# EasyEDA Pro project AD637峰值_运放峰值_AGC_AD8367_万能运放.eprj, board PCB1
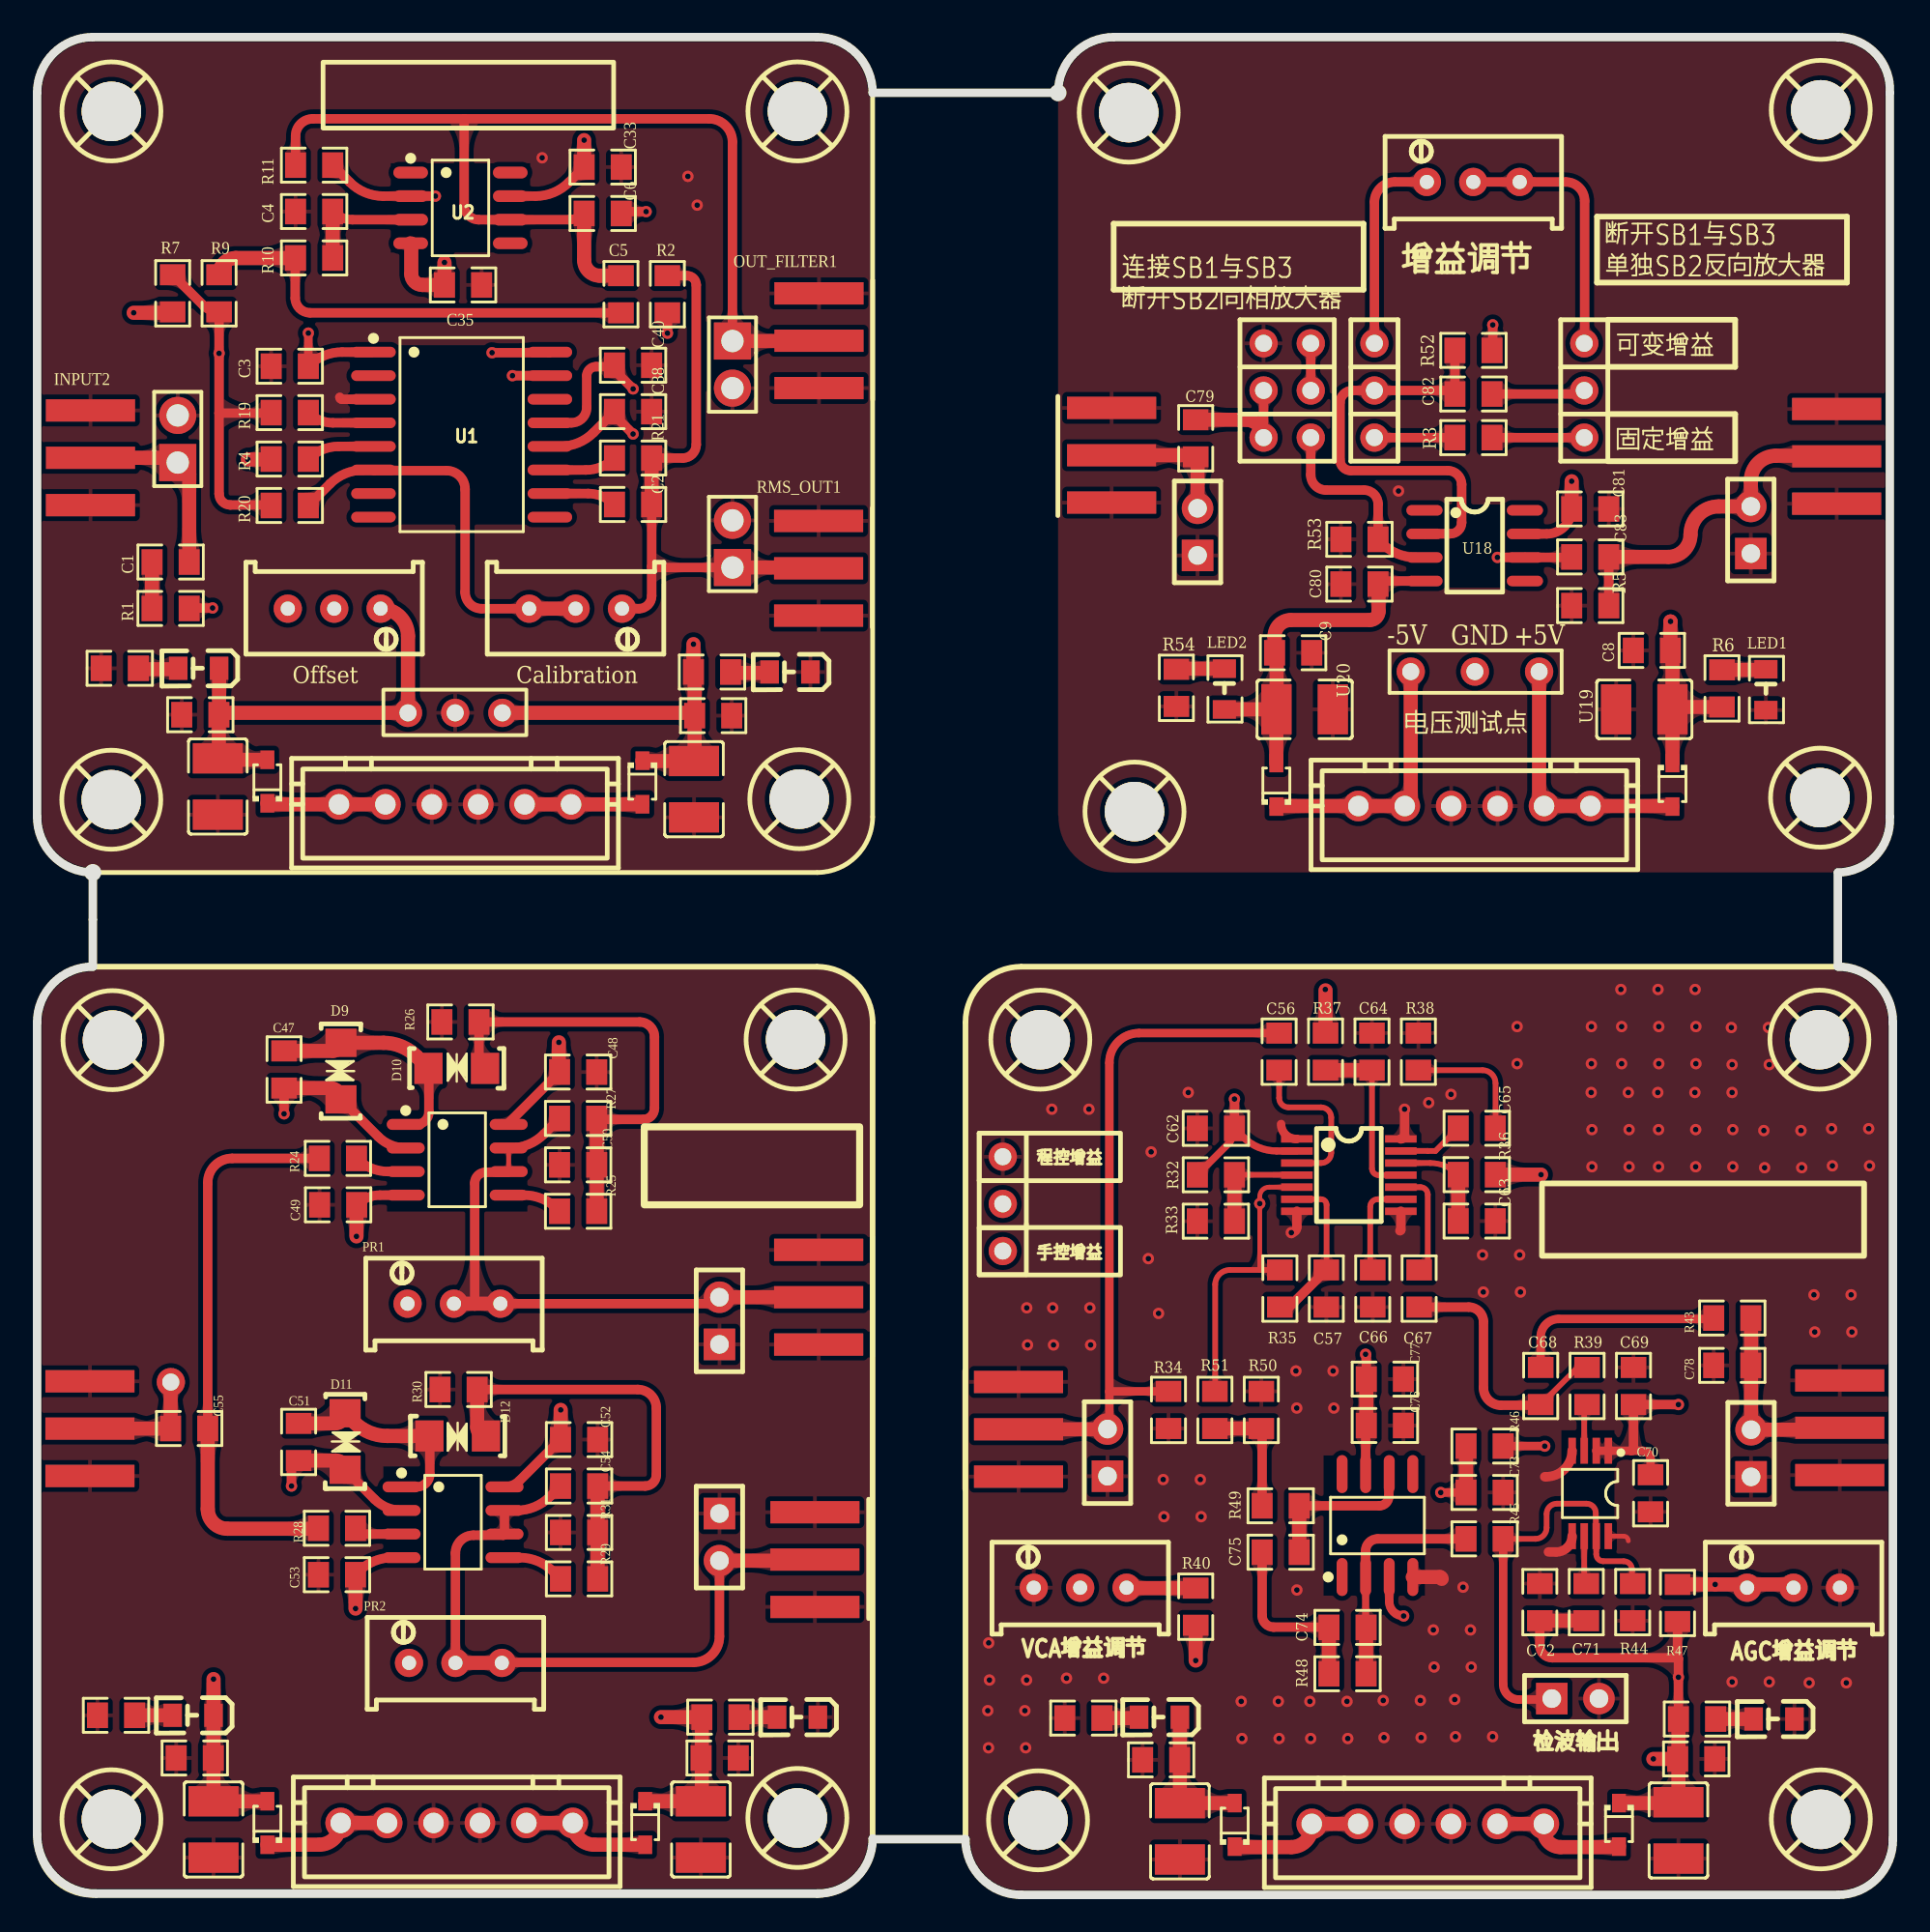
[diagram p3: board, top side]
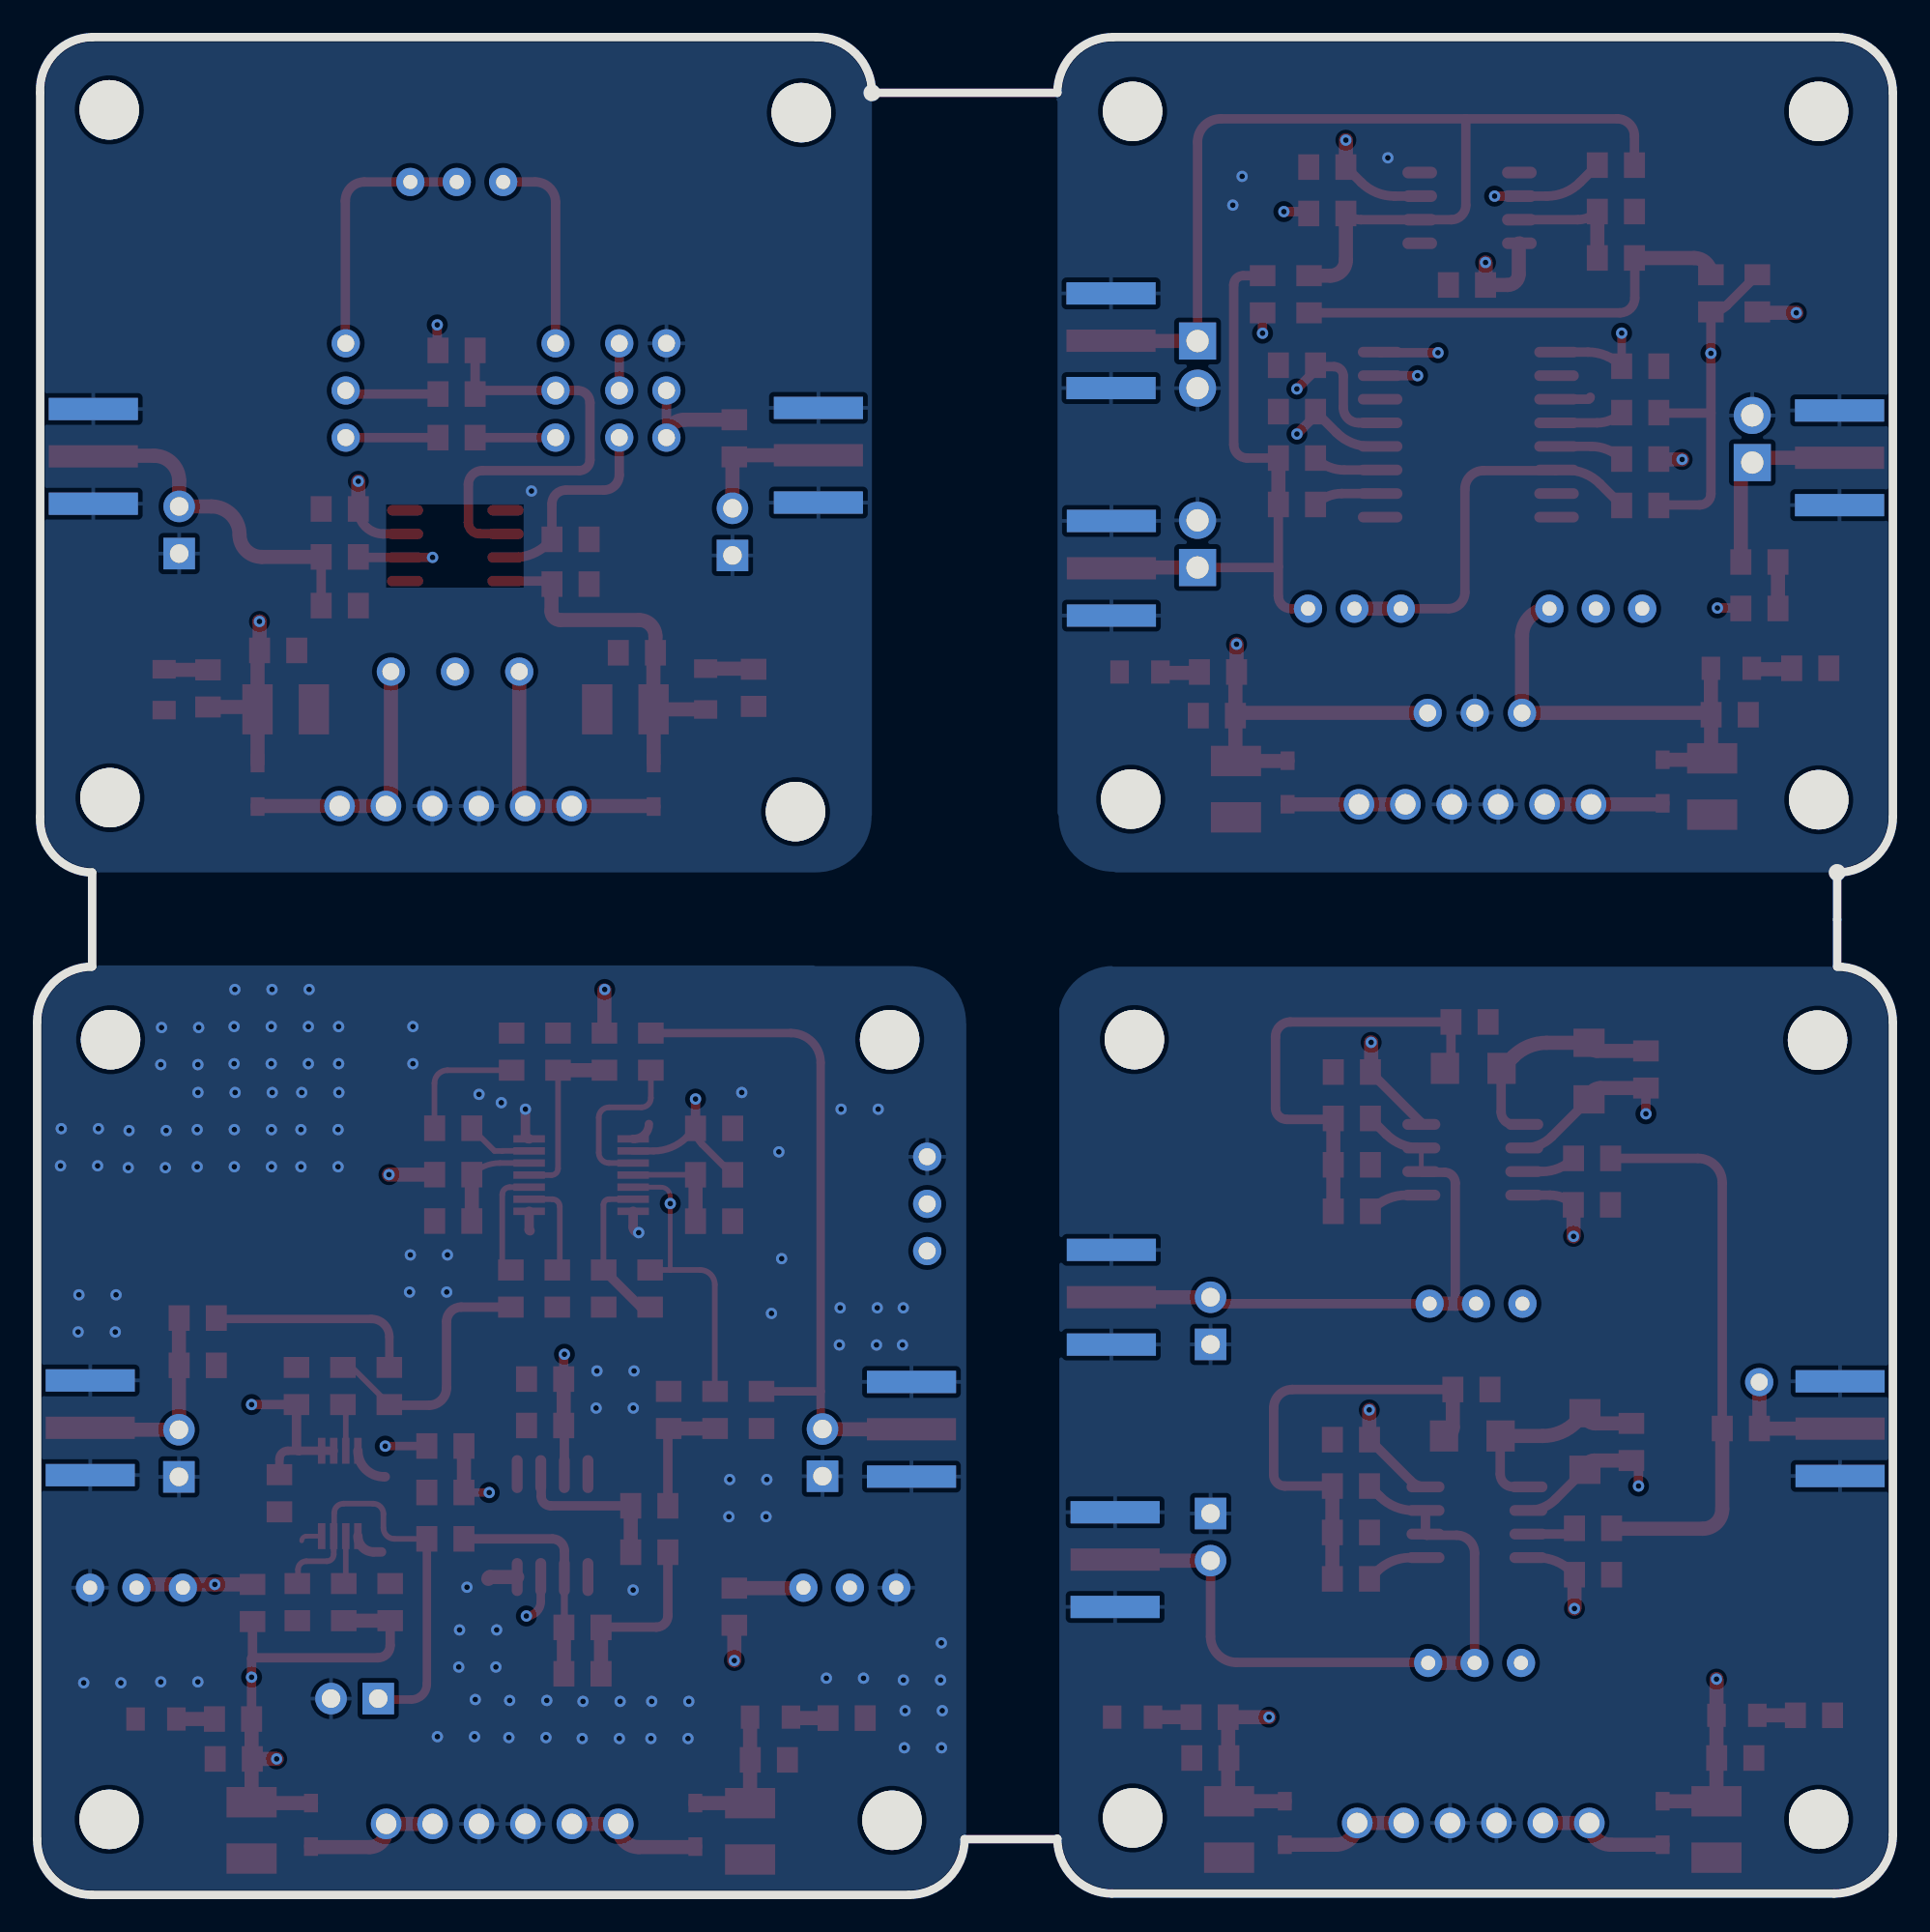
[diagram p4: board, bottom side, seen from below]

Outline 99.95 x 100.07 mm; copper layers: Top Layer, Inner1, Inner2, Bottom Layer. Coordinates in mm from the lower left corner of the outline.
Outline path: 0,97.07 arc(0.88,99.19) 3,100.07 42,100.07 arc(44.12,99.19) 45,97.07 54.99,97.07 arc(55.87,99.19) 57.99,100.07 96.99,100.07 arc(99.03,99.17) 99.79,97.07 99.79,58.07 arc(99.03,55.97) 96.99,55.07 96.99,50.01 arc(96.99,50) 97,50 arc(99.1,49.12) 99.95,47 99.95,3 arc(99.1,0.88) 97,0 53,0 arc(50.88,0.88) 50,3 45.02,3 arc(45.01,3.01) 45,3.02 arc(44.14,0.94) 42.05,0.07 3.17,0.07 arc(0.93,1) 0,3.24 0,47 arc(0.88,49.12) 3,50 3,55.07 arc(0.88,55.95) 0,58.07 0,97.07
Stack: Top Layer 0.035mm 外层铜厚1oz / Dielectric1 0.2104mm 7628 RC49% 8.6mil / Inner1 0.0152mm 内层铜厚 / Dielectric2 1.065mm 1.1mm H/HOZ Copper / Inner2 0.0152mm 内层铜厚 / Dielectric3 0.2104mm 7628 RC49% 8.6mil / Bottom Layer 0.035mm 外层铜厚1oz

## Design rules (mm)
template: JLCPCB Capability(Two Layers Board)
spacing copperThickness1oz (default): track to track 0.102, other pairs 0.152 to 0.3
spacing copperThickness2oz: track to track 0.203, other pairs 0.152 to 0.3
track width copperThickness1oz (default): min 0.127, default 0.254, max 2.54
track width copperThickness2oz: min 0.203, default 0.254, max 2.54
differential pair differentialPair (default): width min 0.127, default 0.254, max 2.54; gap min 0.152, default 0.152
via viaSize (default): diameter min 0.5, default 0.61, max 10; hole min 0.3, default 0.305, max 6.3

## Placement (name value [footprint] x y rotation side)
C1  10uF  [R0805#2]  7.3 71.8 0 top
C2  1uF  [R0805#2]  32.21 74.9 0 top
C3  10uF  [R0805#2]  13.5 82.34 180 top
C4  1uF  [R0805#2]  14.81 90.68 180 top
C5  1uF  [R0805#2]  31.44 86.33 90 top
C6  100nF  [R0805#2]  30.35 90.57 180 top
C8  0.1uF  [R0805#2]  87.08 67.04 0 top
C9  0.1uF  [R0805#2]  67.76 66.91 0 top
C25  100nF  [R0805#2]  8.9 63.57 0 top
C26  100nF  [R0805#2]  36.3 63.52 180 top
C33  100nF  [R0805#2]  30.35 93.07 180 top
C35  100nF  [R0805#2]  23.05 86.72 0 top
C38  100nF  [R0805#2]  32.21 79.9 0 top
C40  100nF  [R0805#2]  31.99 82.4 180 top
C41  22uF  [C1210]  35.38 59.56 90 top
C42  22uF  [C1210]  9.73 59.71 90 top
C43  100nF  [R0805#2]  8.6 7.37 0 top
C44  100nF  [R0805#2]  36.65 7.37 180 top
C45  22uF  [C1210]  35.75 3.52 90 top
C46  22uF  [C1210]  9.5 3.52 90 top
C47  100nF  [R0805#2]  13.3 44.57 90 top
C48  100nF  [R0805#2]  29.25 44.32 0 top
C49  100nF  [R0805#2]  16.1 37.17 180 top
C50  100nF  [R0805#2]  29.25 39.32 0 top
C51  100nF  [R0805#2]  14.08 24.51 90 top
C52  100nF  [R0805#2]  29.3 24.52 0 top
C53  100nF  [R0805#2]  16.04 17.25 180 top
C54  100nF  [R0805#2]  29.3 19.52 0 top
C55  100nF  [R0805#2]  8.3 25.12 0 top
C56  10nF  [R0805#2]  66.89 45.31 270 top
C57  100nF  [R0805#2]  69.44 32.77 90 top
C58  100nF  [R0805#2]  60.65 7.27 0 top
C59  100nF  [R0805#2]  89.25 7.32 180 top
C60  22uF  [C1210]  88.4 3.47 90 top
C61  22uF  [C1210]  61.55 3.42 90 top
C62  1uF  [R0805#2]  63.6 41.29 0 top
C63  100nF  [R0805#2]  77.43 36.3 180 top
C64  100nF  [R0805#2]  71.89 45.53 90 top
C65  10uF  [R0805#2]  77.65 41.3 0 top
C66  10uF  [R0805#2]  71.94 32.55 270 top
C67  10nF  [R0805#2]  74.44 32.55 270 top
C68  10nF  [R0805#2]  80.98 27.52 90 top
C69  100nF  [R0805#2]  85.98 27.52 90 top
C70  10nF  [R0805#2]  86.9 21.52 270 top
C71  270nF  [R0805#2]  83.44 15.66 270 top
C72  10nF  [R0805#2]  80.94 15.88 90 top
C73  100nF  [R0805#2]  77.85 21.68 180 top
C74  20pF  [R0805#2]  70.47 14.41 180 top
C75  3.3nF  [R0805#2]  66.87 18.46 180 top
C76  100nF  [R0805#2]  72.7 25.28 0 top
C77  10nF  [R0805#2]  72.7 27.78 0 top
C78  nc  [R0805#2]  91.19 28.52 180 top
C79  100pF  [R0805#2]  62.4 78.57 90 top
C80  104  [R0805#2]  71.33 70.61 0 top
C81  104  [R0805#2]  83.54 74.66 180 top
C82  33pF  [R0805#2]  77.47 80.85 0 top
C83  100pF  [R0805#2]  83.76 72.07 0 top
Calibration  10kΩ  [RES-ADJ-TH_3P-L10.0-W10.0-P2.50-L]  29 69.28 180 top
CN23  XH2.54*6P_直插  [CONN-TH_XH2.54-6P]  22.51 58.74 0 top
CN24  XH2.54*6P_直插  [CONN-TH_XH2.54-6P]  22.6 3.87 0 top
CN25  XH2.54*6P_直插  [CONN-TH_XH2.54-6P]  74.9 3.82 0 top
CN26  XH2.54*6P_直插  [CONN-TH_XH2.54-6P]  77.41 58.65 0 top
D1  SD103AWS  [SOD-323_L1.8-W1.3-LS2.5-RD]  32.6 59.92 270 top
D2  SD103AWS  [SOD-323_L1.8-W1.3-LS2.5-RD]  12.4 59.97 90 top
D3  led0805  [LED0805-RD]  40.55 65.87 180 top
D4  led0805  [LED0805-RD]  8.7 66.07 180 top
D5  led0805  [LED0805-RD]  40.95 9.57 180 top
D6  led0805  [LED0805-RD]  8.4 9.67 180 top
D7  SD103AWS  [SOD-323_L1.8-W1.3-LS2.5-RD]  32.75 3.87 270 top
D8  SD103AWS  [SOD-323_L1.8-W1.3-LS2.5-RD]  12.4 3.87 90 top
D9  IN60  [LL-34_L3.5-W1.5-BI]  16.36 44.38 90 top
D10  IN60  [LL-34_L3.5-W1.5-BI]  22.6 44.52 0 top
D11  IN60  [LL-34_L3.5-W1.5-BI]  16.59 24.42 270 top
D12  IN60  [LL-34_L3.5-W1.5-BI]  22.65 24.72 180 top
D13  led0805  [LED0805-RD]  93.55 9.47 180 top
D14  led0805  [LED0805-RD]  60.45 9.57 180 top
D15  SD103AWS  [SOD-323_L1.8-W1.3-LS2.5-RD]  85.2 3.77 270 top
D16  SD103AWS  [SOD-323_L1.8-W1.3-LS2.5-RD]  64.5 3.77 90 top
D17  SD103AWS  [SOD-323_L1.8-W1.3-LS2.5-RD]  88.08 59.8 270 top
D18  SD103AWS  [SOD-323_L1.8-W1.3-LS2.5-RD]  66.74 59.8 90 top
H1  -  [HDR-TH_2P-P2.54-V-F]  36.75 30.92 90 top
H2  -  [HDR-TH_2P-P2.54-V-F]  36.75 19.27 270 top
H3  -  [HDR-TH_2P-P2.54-V-F]  82.85 10.57 0 top
H5  -  [HDR-TH_2P-P2.54-V-F]  57.65 23.82 90 top
H6  -  [HDR-TH_2P-P2.54-V-F]  92.31 23.79 90 top
H7  -  [HDR-TH_2P-P2.54-V-F]  62.5 73.42 90 top
H8  -  [HDR-TH_2P-P2.54-V-F]  92.3 73.52 90 top
INPUT2  PZ254V-11-02P  [HDR-TH_2P-P2.54-V-M]  7.57 78.42 90 top
LED1  -  [LED_0805]  93.12 64.97 90 top
LED2  -  [LED_0805]  63.95 65 90 top
NOREF  -  [Pad_e860]  73.98 65.89 0 top
NOREF#2  -  [Pad_e74]  19.98 63.67 0 top
NOREF#3  -  [Pad_e75]  22.52 63.67 0 top
NOREF#4  -  [Pad_e78]  25.06 63.67 0 top
NOREF#5  -  [Pad_e110]  7.2 27.62 0 top
NOREF#6  -  [Pad_e861]  77.44 65.89 0 top
NOREF#7  -  [Pad_e862]  80.9 65.89 0 top
Offset  100kΩ  [RES-ADJ-TH_3P-L10.0-W10.0-P2.50-L]  16 69.28 180 top
OUT_FILTER1  PZ254V-11-02P  [HDR-TH_2P-P2.54-V-M]  37.45 82.43 270 top
PR1  10kΩ  [R_3296]  22.45 31.97 0 top
PR2  10kΩ  [R_3296]  22.53 12.62 0 top
PR3  10kΩ  [R_3296]  56.18 16.67 0 top
PR4  10kΩ  [R_3296]  94.6 16.67 0 top
PR5  10kΩ  [R_3296]  77.35 92.4 0 top
R1  100  [R0805]  7.19 69.3 180 top
R2  500k  [R0805]  33.94 86.22 90 top
R3  511Ω  [R0805]  77.36 78.5 0 top
R4  4.7KΩ  [R0805]  13.61 77.34 0 top
R5  51Ω  [R0805]  83.65 69.45 180 top
R6  1K  [R0805]  90.75 64.99 270 top
R7  1MΩ  [R0805]  7.3 86.27 90 top
R9  1M  [R0805]  9.8 86.27 90 top
R10  1M  [R0805]  14.92 88.18 0 top
R11  2.2M  [R0805]  14.92 93.18 180 top
R17  10K  [R0805]  4.45 66.07 0 top
R18  10K  [R0805]  36.35 65.87 0 top
R19  0  [R0805]  13.61 79.84 0 top
R20  0  [R0805]  13.61 74.84 0 top
R21  0  [R0805]  32.1 77.4 0 top
R22  10K  [R0805]  4.25 9.67 0 top
R23  10K  [R0805]  36.8 9.57 0 top
R24  10K  [R0805]  16.2 39.67 0 top
R25  10K  [R0805]  29.14 36.82 180 top
R26  10K  [R0805]  22.8 47.02 0 top
R27  10K  [R0805]  29.14 41.82 180 top
R28  10K  [R0805]  16.15 19.75 0 top
R29  10K  [R0805]  29.19 17.02 180 top
R30  10K  [R0805]  22.7 27.22 0 top
R31  10K  [R0805]  29.19 22.02 180 top
R32  10K  [R0805]  63.49 38.79 0 top
R33  10K  [R0805]  63.49 36.29 0 top
R34  57.6  [R0805]  60.93 26.12 90 top
R35  10K  [R0805]  66.94 32.66 270 top
R36  2.2  [R0805]  77.54 38.8 0 top
R37  2.2  [R0805]  69.39 45.42 90 top
R38  100  [R0805]  74.39 45.42 270 top
R39  100  [R0805]  83.48 27.41 270 top
R40  10K  [R0805]  62.4 15.52 270 top
R41  10K  [R0805]  56.35 9.52 0 top
R42  10K  [R0805]  89.4 9.47 0 top
R43  50  [R0805]  91.3 31.07 0 top
R44  12K  [R0805]  85.94 15.77 90 top
R45  150  [R0805]  77.96 19.18 0 top
R46  50  [R0805]  77.96 24.18 0 top
R47  1K  [R0805]  88.35 15.72 270 top
R48  82K  [R0805]  70.58 11.91 180 top
R49  33k  [R0805]  66.98 20.96 180 top
R50  10K  [R0805]  65.93 26.12 90 top
R51  10K  [R0805]  63.43 26.12 270 top
R52  51Ω  [R0805]  77.36 83.2 180 top
R53  51Ω  [R0805]  71.22 73.02 0 top
R54  1K  [R0805]  61.36 65.02 90 top
RMS_OUT1  PZ254V-11-02P  [HDR-TH_2P-P2.54-V-M]  37.45 72.77 90 top
SCREW1  -  [M3螺丝]  4 96.07 0 top
SCREW2  -  [M3螺丝]  40.95 96.07 0 top
SCREW3  -  [M3螺丝]  3.99 58.99 0 top
SCREW4  -  [M3螺丝]  41.05 59.02 0 top
SCREW5  -  [M3螺丝]  58.79 96.01 0 top
SCREW6  -  [M3螺丝]  59.1 58.36 0 top
SCREW7  -  [M3螺丝]  96.07 96.16 0 top
SCREW8  -  [M3螺丝]  96.03 59.11 0 top
SCREW9  -  [M3螺丝]  53.91 4.02 0 top
SCREW10  -  [M3螺丝]  96.07 4.07 0 top
SCREW11  -  [M3螺丝]  54.03 46.07 0 top
SCREW12  -  [M3螺丝]  95.99 46.07 0 top
SCREW13  -  [M3螺丝]  4 4.07 0 top
SCREW14  -  [M3螺丝]  40.95 4.14 0 top
SCREW15  -  [M3螺丝]  4.06 46.04 0 top
SCREW16  -  [M3螺丝]  40.85 46.07 0 top
U1  AD637ARZ  [SOIC-16_L10.3-W7.5-P1.27-LS10.3-BL]  22.87 78.66 270 top
U2  OP07  [SOP-8_L4.9-W3.9-P1.27-LS6.0-BL]  22.8 90.87 270 top
U3  -  [SMA]  45.92 89.58 180 top
U4  -  [SMA]  -0.94 71.55 0 top
U5  -  [SMA]  45.9 77.32 180 top
U6  NE5532DR  [SOIC-8_L4.9-W3.9-P1.27-LS6.0-BL]  22.62 39.6 270 top
U7  NE5532DR  [SOIC-8_L4.9-W3.9-P1.27-LS6.0-BL]  22.4 20.07 270 top
U8  -  [SMA]  -0.97 19.25 0 top
U9  -  [SMA]  45.9 38.06 180 top
U10  -  [SMA]  45.7 23.92 180 top
U11  AD8367ARUZ-RL7  [TSSOP-14_L5.0-W4.4-P0.65-LS6.4-BL]  70.65 38.77 270 top
U12  AD820ARZ  [SOIC-8_L4.9-W3.9-P1.27-LS6.0-BL]  72.19 19.89 0 top
U13  AD8361ARMZ  [MSOP-8_L3.0-W3.0-P0.65-LS4.9-BL]  83.65 21.62 180 top
U14  -  [1*3跳线]  52.01 39.76 180 top
U15  -  [SMA]  49.05 19.22 0 top
U16  -  [SMA]  100.9 31.02 180 top
U17  -  [3*3连跳线帽]  71.14 88.66 0 top
U18  -  [THS4001CD]  77.53 72.07 0 top
U19  100uF  [C1210]  86.56 63.86 0 top
U20  100uF  [C1210]  68.27 63.86 0 top
U21  -  [1*3选择跳线帽]  72.03 78.5 270 top
U22  -  [1*3选择跳线帽]  83.33 83.58 90 top
U23  -  [SMA]  54.06 71.69 0 top
U24  -  [SMA]  100.73 83.35 180 top

## Footprints (pads in the part's own frame, mm; a bottom-side part is the same pattern mirrored in y, then rotated)
1*3跳线
  round 1.524 hole 0.914: 1(0,5.08) 2(0,2.54) 3(0,0)
1*3选择跳线帽
  round 1.524 hole 0.914: 1(-5.08,0) 2(-2.54,0) 3(0,0)
3*3连跳线帽
  round 1.524 hole 0.914: 1(-5.08,-5.08) 2(-5.08,-7.62) 3(-5.08,-10.16) 4(-2.54,-5.08) 5(-2.54,-7.62) 6(-2.54,-10.16)
C1210
  rect 1.635x2.7 smd: 1(-1.518,0) 2(1.518,0)
CONN-TH_XH2.54-6P
  round 1.65 hole 1.1: 1(-6.25,0) 2(-3.75,0) 3(-1.25,0) 4(1.25,0) 5(3.75,0) 6(6.25,0)
HDR-TH_2P-P2.54-V-F
  rect 1.7x1.7 hole 1: 1(-1.27,0)
  round 1.7 hole 1: 2(1.27,0)
HDR-TH_2P-P2.54-V-M
  rect 2x2 hole 1.2: 1(-1.27,0)
  round 2 hole 1.2: 2(1.27,0)
LED0805-RD
  rect 1x1.25 smd: 1(-1.1,0) 2(1.1,0)
LED_0805
  rect 1x1.25 smd: 1(-1.15,0.005) 2(1.05,0.005)
LL-34_L3.5-W1.5-BI
  rect 1.524x1.677 smd: 1(-1.524,0) 2(1.524,0)
M3螺丝
  round 3.2 hole 3.2: 1(0,0)
MSOP-8_L3.0-W3.0-P0.65-LS4.9-BL
  rect 0.406x1.397 smd: 1(-0.975,-2.3) 2(-0.325,-2.3) 3(0.325,-2.3) 4(0.975,-2.3) 5(0.975,2.3) 6(0.325,2.3) 7(-0.325,2.3) 8(-0.975,2.3)
Pad_e74
  round 1.524 hole 0.914: 1(0,0)
Pad_e75
  round 1.524 hole 0.914: 2(0,0)
Pad_e78
  round 1.524 hole 0.914: 3(0,0)
Pad_e110
  round 1.524 hole 0.914: 1(0,0)
Pad_e860
  round 1.524 hole 0.914: 1(0,0)
Pad_e861
  round 1.524 hole 0.914: 2(0,0)
Pad_e862
  round 1.524 hole 0.914: 3(0,0)
R0805
  rect 1.133x1.377 smd: 1(-1,0) 2(1,0)
R0805#2
  rect 1.133x1.377 smd: 1(-1.111,0) 2(0.889,0)
R_3296
  round 1.524 hole 0.762: 1(-2.499,-0.127) 2(0,-0.127) 3(2.499,-0.127)
RES-ADJ-TH_3P-L10.0-W10.0-P2.50-L
  round 1.524 hole 0.762: 1(-2.5,0) 2(0,0) 3(2.5,0)
SMA
  rect 4.8x1.2 smd: 1(3.81,8.412) 2(3.81,3.312) 5(3.81,5.862)
  rect 4.8x1.2 smd far side: 3(3.81,3.312) 4(3.81,8.412)
SOD-323_L1.8-W1.3-LS2.5-RD
  rect 1x0.75 smd: 1(-1.173,0) 2(1.173,0)
SOIC-8_L4.9-W3.9-P1.27-LS6.0-BL
  oval 0.588x2.045 smd: 1(-1.905,-2.772) 2(-0.635,-2.772) 3(0.635,-2.772) 4(1.905,-2.772) 5(1.905,2.772) 6(0.635,2.772) 7(-0.635,2.772) 8(-1.905,2.772)
SOIC-16_L10.3-W7.5-P1.27-LS10.3-BL
  oval 0.574x2.401 smd: 1(-4.445,-4.75) 2(-3.175,-4.75) 3(-1.905,-4.75) 4(-0.635,-4.75) 5(0.635,-4.75) 6(1.905,-4.75) 7(3.175,-4.75) 8(4.445,-4.75) 9(4.445,4.75) 10(3.175,4.75) 11(1.905,4.75) 12(0.635,4.75) 13(-0.635,4.75) 14(-1.905,4.75) 15(-3.175,4.75) 16(-4.445,4.75)
SOP-8_L4.9-W3.9-P1.27-LS6.0-BL
  oval 0.63x1.865 smd: 1(-1.905,-2.683) 2(-0.635,-2.683) 3(0.635,-2.683) 4(1.905,-2.683) 5(1.905,2.683) 6(0.635,2.683) 7(-0.635,2.683) 8(-1.905,2.683)
THS4001CD
  oval 1.95x0.569 smd: 1(-2.804,2.51) 2(-2.804,1.24) 3(-2.804,-0.029) 4(-2.804,-1.3) 5(2.606,-1.3) 6(2.606,-0.029) 7(2.606,1.24) 8(2.606,2.51)
TSSOP-14_L5.0-W4.4-P0.65-LS6.4-BL
  rect 0.4x1.7 smd: 1(-1.95,-2.8) 2(-1.3,-2.8) 3(-0.65,-2.8) 4(0,-2.8) 5(0.65,-2.8) 6(1.3,-2.8) 7(1.95,-2.8) 8(1.95,2.8) 9(1.3,2.8) 10(0.65,2.8) 11(0,2.8) 12(-0.65,2.8) 13(-1.3,2.8) 14(-1.95,2.8)

## Nets
As in the schematic, except:
+5V: C26.2 C33.2 C40.2 C41.2 C44.2 C45.2 C48.1 C52.1 C59.2 C60.2 C62.2 C69.1 C70.1 C71.2 C72.1 C76.1 C77.1 D1.1 D7.1 D15.1 NOREF#4.3 Offset.3 R4.1 R18.1 R23.1 R32.1 R36.2 R37.2 R40.2 R42.1 R47.2 U1.13 U2.7 U6.8 U7.8 U11.2 U12.7 U13.1 U13.2
-5V: C9.1 C25.2 C35.1 C38.1 C42.2 C43.2 C46.2 C49.1 C53.1 C58.2 C61.2 C80.2 D2.2 D4.1 D6.1 D8.2 D14.1 D16.2 D18.2 LED2.1 NOREF#2.1 Offset.1 U1.12 U2.4 U6.4 U7.4 U18.4 U20.1
GND: C3.2 C4.2 C8.1 C9.2 C25.1 C26.1 C33.1 C35.2 C38.2 C40.1 C41.1 C42.1 C43.1 C44.1 C45.1 C46.1 C48.2 C49.2 C50.1 C52.2 C53.2 C54.1 C57.1 C58.1 C59.1 C60.1 C61.1 C62.1 C63.1 C64.2 C66.2 C69.2 C70.2 C72.2 C73.1 C76.2 C77.2 C78.2 C80.1 C81.1 CN23.3 CN23.4 CN24.3 CN24.4 CN25.3 CN25.4 CN26.3 CN26.4 D3.1 D5.1 D13.1 H1.1 H2.1 H3.2 H5.1 H6.1 H7.1 H8.1 INPUT2.2 LED1.1 NOREF#3.2 OUT_FILTER1.2 PR3.1 PR4.3 R5.2 R17.1 R22.1 R26.1 R30.1 R33.1 R34.1 R38.1 R41.1 R44.1 R50.2 R53.1 R54.1 RMS_OUT1.2 U1.3 U3.1 U3.2 U3.3 U3.4 U4.1 U4.2 U4.3 U4.4 U5.1 U5.2 U5.3 U5.4 U8.1 U8.2 U8.3 U8.4 U9.1 U9.2 U9.3 U9.4 U10.1 U10.2 U10.3 U10.4 U11.1 U11.7 U11.8 U11.14 U12.4 U13.4 U13.5 U13.8 U14.3 U15.1 U15.2 U15.3 U15.4 U16.1 U16.2 U16.3 U16.4 U17.1 U19.1 U20.2 U23.1 U23.2 U23.3 U23.4 U24.1 U24.2 U24.3 U24.4
$1N12290: C55.1 NOREF#5.1 U8.5
$3N1248: CN26.1 CN26.2 D18.1 NOREF.1
$3N1250: CN26.5 CN26.6 D17.2 NOREF#7.3

Pads without a net: NOREF#6 2; SCREW1 1; SCREW2 1; SCREW3 1; SCREW4 1; SCREW5 1; SCREW6 1; SCREW7 1; SCREW8 1; SCREW9 1; SCREW10 1; SCREW11 1; SCREW12 1; SCREW13 1; SCREW14 1; SCREW15 1; SCREW16 1; U1 2 7 8 9 14; U2 1 5 8; U12 1 5 8; U18 1 5 8

## Via types
v1: diameter 0.61, hole 0.305, Top Layer to Bottom Layer, 150 vias

## Routing (per net, layer and track width the routed paths; a pad name or vN(x,y) marks a point on that pad's centre or on a via; arc(x,y) is an arc through that point)
+5V: length 321.1
  Top Layer w0.381: R32.1 64.14,40.44 arc(64.4,40.83) C62.2 64.96,40.82 arc(65.79,40.27) 66.76,40.07 U11.2
  Top Layer w0.457: U13.2 U13.1 86.45,23.92 arc(86.77,23.79) 86.9,23.47 C70.1
  Top Layer w0.508: 88.35,12.77 81.6,12.77 arc(81.13,12.97) 80.94,13.44 C72.1 ; 88.35,12.77 R47.2 ; 88.35,12.77 arc(88.39,12.76) 88.4,12.72 v1(88.4,11.73) R42.1 ; U1.13 28.77,79.3 arc(29.36,79.54) 29.6,80.12 29.6,81.82 arc(29.75,82.18) 30.1,82.32 31.02,82.32 arc(31.07,82.34) C40.2 31.1,82.13 v1(32.1,81.12) ; 71.59,27.78 71.59,29.08 arc(71.58,29.11) v1(71.55,29.12) ; U12.7 71.55,25.25 arc(71.56,25.27) 71.59,25.28 ; v1(88.4,26.41) C69.1 85.98,24.05 arc(85.94,23.96) 85.86,23.92 ; U2.7 26.84,91.51 arc(27.82,91.7) 28.64,92.25 C33.2 ; C62.2 v1(64.49,42.87) ; C48.1 25.45,41.64 arc(25.41,41.58) U6.8 ; 28.19,24.52 25.98,22.31 arc(25.61,22.06) U7.8
  Top Layer w0.762: v1(87.05,7.32) C59.2 ; C26.2 35.41,65.76 arc(35.39,65.81) 35.35,65.82 ; C26.2 35.41,61.11 arc(35.4,61.09) C41.2 32.62,61.08 arc(32.6,61.08) D1.1 ; C26.2 arc(35.37,63.63) 35.26,63.67 NOREF#4.3 ; R37.2 69.39,48.72 ; v1(28.1,45.92) 28.1,44.36 arc(28.11,44.34) C48.1 ; v1(28.2,26.12) 28.2,24.53 arc(28.2,24.53) 28.19,24.52 ; C33.2 v1(29.46,94.52) ; v1(35.35,67.37) R18.1 ; C72.1 C71.2 ; D7.1 35.74,5.05 arc(35.75,5.04) C45.2 arc(35.79,5.06) 35.8,5.09 R23.1 v1(33.6,9.57) ; R36.2 v1(81,38.8) ; 71.59,27.78 71.59,25.28 ; R42.1 C60.2 arc(88.39,4.96) 88.36,4.95 D15.1 ; v1(11.35,77.32) 12.58,77.32 arc(12.6,77.33) R4.1 ; R40.2 v1(62.4,12.62)
  Inner1 w0.762: v1(71.55,29.12) 80.75,29.12 ; 80.75,29.12 87.7,29.12 arc(88.19,28.92) 88.4,28.42 v1(88.4,26.41) 88.4,11.92 ; 80.75,29.12 arc(80.89,29.18) 80.95,29.32 80.95,47.87 arc(80.69,48.51) 80.05,48.77 v1(69.38,48.77) 65.4,48.77 arc(64.76,48.51) 64.49,47.86 v1(64.49,42.87) ; v1(29.46,94.52) 29.46,82.21 arc(29.78,81.44) 30.55,81.12 v1(32.1,81.12) 34.1,81.12 arc(34.98,80.76) 35.35,79.87 v1(35.35,67.37) ; v1(87.05,7.32) 63.75,7.32 arc(62.8,7.72) 62.4,8.67 v1(62.4,12.62) ; v1(33.6,9.57) 33.6,26.11 ; 33.6,26.11 33.6,44.42 arc(33.16,45.48) 32.1,45.92 v1(28.1,45.92) ; 33.6,26.11 arc(33.6,26.12) 33.59,26.12 v1(28.2,26.12) ; v1(11.35,77.32) 11.35,70.27 arc(11.64,69.57) 12.35,69.27 13.49,69.27 arc(13.5,69.28) Offset.3
  Inner2 w0.762: 14.75,65.92 23.95,65.92 arc(24.73,65.6) 25.05,64.82 25.05,63.68 arc(25.05,63.67) NOREF#4.3 ; Offset.3 13.5,67.22 arc(13.87,66.34) 14.75,65.97
-5V: length 157.7
  Top Layer w0.508: 72.33,69.96 72.4,70.03 ; U1.12 28.17,78.03 arc(29.14,78.22) 29.97,78.77 C38.1 31.1,79.69 v1(32.1,78.69) ; U7.4 19.12,18.17 arc(18.15,17.97) 17.33,17.42 C53.1 ; U6.4 18.47,37.69 arc(17.79,37.56) C49.1 ; U18.4 72.62,70.77 arc(72.41,70.73) C80.2
  Top Layer w0.762: 72.25,69.93 72.25,69.15 arc(72.11,68.81) 71.77,68.67 67.52,68.67 arc(66.91,68.42) 66.65,67.8 C9.1 ; 19.98,63.72 19.98,67.81 arc(19.54,68.85) Offset.1 ; v1(9.5,11.62) D6.1 C46.2 12.4,5.04 arc(12.4,5.04) D8.2 ; D14.1 C61.2 arc(61.55,4.94) 61.56,4.95 D16.2 ; C53.1 v1(17.15,15.42) ; v1(21.94,87.93) C35.1 20.75,86.72 arc(20.33,86.9) 20.15,87.32 20.15,88.94 arc(20.14,88.96) U2.4 ; v1(17.2,35.47) 17.2,37.16 arc(17.2,37.17) C49.1 ; U20.1 63.95,63.86 arc(63.95,63.86) LED2.1 ; U20.1 arc(66.76,63.86) 66.76,63.87 66.76,66.91 ; U20.1 arc(66.75,63.86) 66.74,63.85 D18.2 ; D2.2 9.81,61.15 arc(9.76,61.17) C42.2 arc(9.77,61.24) 9.79,61.28 C25.2 arc(9.79,63.6) 9.8,63.62 ; 9.8,63.62 9.8,66.02 ; 9.8,63.62 arc(9.84,63.66) 9.89,63.67 NOREF#2.1
  Inner1 w0.762: v1(9.5,11.62) 9.5,15.51 ; 9.5,15.51 9.5,34.02 arc(9.92,35.05) 10.95,35.47 v1(17.2,35.47) ; 9.5,15.51 arc(9.53,15.45) 9.59,15.42 v1(17.15,15.42) ; 21.93,71.62 19.3,71.62 arc(18.73,71.39) 18.5,70.82 Offset.1 ; 21.93,71.62 31.05,71.62 arc(31.79,71.93) 32.1,72.67 v1(32.1,78.69) ; 21.93,71.62 arc(21.94,71.63) 21.94,71.63 v1(21.94,87.93)
GND: length 14.2
  Top Layer w0.254: U13.8 85.45,19.32 arc(85.63,19.25) 85.7,19.07
  Top Layer w0.457: U11.1 67.8,40.72 arc(67.23,40.96) 67,41.52
  Top Layer w0.508: 18.12,80.57 16.41,80.57 arc(16.33,80.6) 16.3,80.67 ; v1(73.65,42.32) 73.65,40.92 arc(73.59,40.78) U11.14 ; U11.7 67.85,35.97 arc(67.76,35.76) v1(67.55,35.67) ; U11.8 73.45,35.82 arc(73.44,35.79) 73.4,35.77 ; 81.4,18.47 81.82,18.47 arc(82.43,18.72) 82.67,19.32 ; 81.2,22.52 81.28,22.52 arc(82.26,22.93) 82.67,23.92
  Top Layer w0.762: U12.4 75.55,17.12 arc(75.62,17.09) 75.65,17.02
  vias: v1(27.2,93.57) v1(35.05,92.57) v1(35.55,91.02) v1(51.25,13.57) v1(51.2,9.92) v1(51.24,7.92) v1(51.29,11.57) v1(53.2,9.92) v1(53.24,7.92) v1(53.3,31.62) v1(53.34,29.62) v1(53.29,11.57) v1(54.65,42.32) v1(54.7,31.62) v1(54.74,29.62) v1(55.44,11.67) v1(56.65,42.32) v1(56.7,31.62) v1(56.74,29.62) v1(57.44,11.67) v1(59.85,34.27) v1(60,40.02) v1(60.4,31.32) v1(60.65,22.37) v1(60.69,20.37) v1(62,43.22) v1(62.65,22.37) v1(62.69,20.37) v1(64.85,10.42) v1(64.89,8.42) v1(66.85,10.42) v1(66.89,8.42) v1(67.8,28.22) v1(67.84,26.22) v1(67.85,16.42) v1(68.55,10.42) v1(68.59,8.42) v1(69.8,28.22) v1(69.84,26.22) v1(70.55,10.42) v1(70.59,8.42) v1(72.5,10.47) v1(72.54,8.47) v1(73.32,75.62) v1(74.5,10.47) v1(74.54,8.47) v1(74.95,42.67) v1(75.2,14.27) v1(75.24,12.27) v1(76.15,43.12) v1(76.35,10.52) v1(76.39,8.52) v1(76.8,16.57) v1(77.2,14.27) v1(77.24,12.27) v1(77.85,34.47) v1(77.89,32.47) v1(78.39,8.52) v1(79.71,46.77) v1(79.71,44.77) v1(79.85,34.47) v1(79.89,32.47) v1(83.71,46.77) v1(83.71,44.77) v1(83.7,43.22) v1(83.74,41.22) v1(83.74,39.22) v1(85.3,48.77) v1(85.34,46.77) v1(85.34,44.77) v1(85.7,43.22) v1(85.74,41.22) v1(85.74,39.22) v1(87.3,48.77) v1(87.34,46.77) v1(87.34,44.77) v1(87.29,43.22) v1(87.33,41.22) v1(87.33,39.22) v1(89.3,48.77) v1(89.34,46.77) v1(89.34,44.77) v1(89.29,43.22) v1(89.33,41.22) v1(89.33,39.22) v1(91.25,46.72) v1(91.29,44.72) v1(91.29,43.22) v1(91.33,41.22) v1(91.33,39.22) v1(91.29,11.47) v1(93,41.17) v1(93.04,39.17) v1(93.25,46.72) v1(93.29,44.72) v1(93.29,11.47) v1(95,41.17) v1(95.04,39.17) v1(95.44,11.42) v1(95.7,32.32) v1(95.74,30.32) v1(96.65,41.27) v1(96.69,39.27) v1(97.44,11.42) v1(97.7,32.32) v1(97.74,30.32) v1(98.65,41.27) v1(98.69,39.27)
VDD: length 27.1
  Top Layer w0.508: U18.7 81.31,73.31 arc(82.26,73.71) C81.2
  Top Layer w0.762: R6.2 88.21,63.99 arc(88.12,63.95) U19.2 ; U19.2 88.08,67.04 ; U19.2 D17.1 ; v1(82.65,76.15) C81.2 ; C8.2 87.97,68.59 arc(87.97,68.6) v1(87.98,68.6)
  Inner2 w0.762: v1(87.98,68.6) 87.98,73.85 arc(87.29,75.49) 85.65,76.17 82.68,76.17 arc(82.66,76.17) v1(82.65,76.15)
BUF: length 25.9
  Top Layer w0.457: C3.1 v1(14.61,84.13)
  Top Layer w0.508: C3.1 14.62,82.36 arc(15.45,82.91) 16.42,83.11 18.12,83.11 ; v1(33.95,84.12) 33.95,85.22 arc(33.95,85.22) R2.1
  Inner2 w0.508: v1(14.61,84.13) 33.94,84.13 arc(33.95,84.13) v1(33.95,84.12)
$1N3231: length 31.7
  Top Layer w0.508: R21.2 34.78,77.4 arc(35.29,77.61) 35.5,78.12 35.5,86.72 arc(35.35,87.08) 35,87.22 R2.2 ; 33.1,71.55 33.1,69.97 arc(32.9,69.49) 32.41,69.28 Calibration.1 ; 33.1,71.55 33.1,74.89 arc(33.1,74.9) C2.2 ; 33.1,71.55 arc(33.11,71.52) 33.15,71.5 RMS_OUT1.1
  Top Layer w0.762: C2.2 R21.2 ; RMS_OUT1.1 42.05,71.5 arc(42.08,71.49) U5.5
$1N3235: length 21.7
  Top Layer w0.508: R20.2 15.77,76.01 arc(16.6,76.56) 17.57,76.76 18.12,76.76 arc(18.12,76.73) 18.15,76.72 22.05,76.72 arc(22.76,76.43) 23.05,75.72 23.05,70.17 arc(23.31,69.55) 23.94,69.28 Calibration.3
  Top Layer w0.762: Calibration.3 Calibration.2
$1N3238: length 3.7
  Top Layer w0.508: 18.12,79.3 15.93,79.3 arc(15.21,79.44) R19.2
$1N3239: length 3.7
  Top Layer w0.508: 18.12,78.03 16.25,78.03 arc(15.36,77.85) R4.2
$1N3240: length 36.9
  Top Layer w0.508: 9.8,79.82 v1(9.8,83.04) R9.1 arc(9.34,85.36) 8.95,85.63 R7.2 ; 9.8,79.82 12.58,79.82 arc(12.6,79.83) R19.1 ; 9.8,79.82 9.8,75.47 arc(9.98,75.05) 10.4,74.87 12.58,74.87 arc(12.6,74.86) R20.1 ; v1(24.5,83.07) 27.58,83.07 arc(27.61,83.08) U1.16
  Inner2 w0.508: v1(24.5,83.07) 9.8,83.07
$1N3243: length 38.7
  Top Layer w0.762: v1(5.2,85.22) 7.25,85.22 arc(7.29,85.24) R7.1
  Inner1 w0.762: Offset.2 16,89.57 arc(15.71,90.28) 15,90.57 6.2,90.57 arc(5.49,90.28) 5.2,89.57 v1(5.2,85.22)
$1N3247: length 10.6
  Top Layer w0.762: U4.5 7.31,77.41 arc(7.5,77.34) INPUT2.1 arc(8.01,76.97) 8.19,76.54 C1.2
$1N3248: length 2.5
  Top Layer w0.762: C1.1 R1.2
$1N3250: length 24.8
  Top Layer w0.508: C5.1 14.7,85.22 arc(14.13,85.46) 13.9,86.02 13.9,88.16 arc(13.9,88.17) 13.91,88.17 arc(13.91,88.18) R10.1
  Top Layer w0.762: 13.91,88.17 10.7,88.17 arc(10.06,87.91) R9.2
$1N3252: length 3.6
  Top Layer w0.508: U1.10 29.67,75.49 arc(30.44,75.33) C2.1
$1N3253: length 31.2
  Top Layer w0.508: v1(9.45,69.32) 8.21,69.32 arc(8.2,69.32) R1.1 ; U1.15 v1(25.6,81.84)
  Inner2 w0.508: v1(25.6,81.84) 11.31,81.84 arc(10.6,81.54) 10.3,80.82 10.3,70.17 arc(10.05,69.57) v1(9.45,69.32)
$1N3256: length 58.4
  Top Layer w0.508: R11.2 13.92,94.74 arc(14.19,95.4) 14.85,95.67 23.03,95.67 ; 23.03,95.67 36.2,95.67 arc(37.08,95.31) 37.45,94.42 OUT_FILTER1.1 ; 23.03,95.67 arc(23.01,95.66) 23,95.65 23,91.02 arc(23.23,90.47) 23.79,90.24 U2.6 28.65,90.24 arc(29.09,90.33) C6.2
  Top Layer w0.762: C5.2 30.3,87.22 arc(29.71,87.47) 29.46,88.06 C6.2 ; OUT_FILTER1.1 42.09,83.7 arc(42.1,83.71) U3.5
$1N3259: length 6.8
  Top Layer w0.508: U2.3 16.98,90.24 arc(16.41,90.35) C4.1
  Top Layer w0.762: R10.2 C4.1
$1N3260: length 19.3
  Top Layer w0.508: v1(32.8,90.67) 31.56,90.67 arc(31.49,90.64) C6.1 ; R11.1 16.84,92.25 arc(17.67,91.7) 18.64,91.51 U2.2 v1(21.45,91.51)
  Inner2 w0.508: v1(21.45,91.51) 31.97,91.51 arc(32.56,91.26) v1(32.8,90.67)
$1N3765: length 6.3
  Top Layer w0.762: CN23.5 CN23.6 32.59,58.74 arc(32.6,58.75) D1.2
$1N3767: length 6.4
  Top Layer w0.762: CN23.2 CN23.1 12.46,58.74 arc(12.42,58.76) D2.1
$1N5708: length 3.7
  Top Layer w0.508: U1.11 29.55,76.76 arc(30.39,76.92) R21.1
$1N8199: length 2.2
  Top Layer w0.762: 7.6,66.02 5.45,66.02
$1N9251: length 2.1
  Top Layer w0.762: 37.35,65.82 39.45,65.82
$1N10609: length 2.1
  Top Layer w0.762: R22.2 D6.2
$1N10610: length 2
  Top Layer w0.762: R23.2 D5.2
$1N10759: length 7.1
  Top Layer w0.762: CN24.2 CN24.1 arc(16.01,3.04) 15.18,2.7 D8.1
$1N10760: length 7.1
  Top Layer w0.762: CN24.5 CN24.6 arc(29.19,3.04) 30.02,2.7 D7.2
$1N11302: length 2.8
  Top Layer w0.508: U6.3 18.91,38.96 arc(17.99,39.15) R24.2
$1N11315: length 25.8
  Top Layer w0.508: v1(13.3,42.07) C47.1 ; D9.1 18.37,40.85 arc(19.05,40.39) U6.2
  Top Layer w0.762: C47.1 15.75,43.46 arc(16.18,43.28) D9.1
  Inner2 w0.508: v1(13.3,42.07) 13.3,32.72 arc(13.56,32.1) 14.18,31.85 PR1.1
$1N11336: length 12.5
  Top Layer w0.508: U6.1 20.43,41.5 arc(20.9,41.7) 21.1,42.17 21.1,44.5 arc(21.09,44.52) D10.1
  Top Layer w0.762: C47.2 15.93,45.46 arc(16.24,45.59) D9.2 18.65,45.9 arc(19.62,45.71) 20.44,45.16 D10.1
$1N11392: length 24.9
  Top Layer w0.508: R27.1 arc(30.15,41.79) 30.19,41.77 32.65,41.77 arc(33.07,41.95) 33.25,42.37 33.25,46.22 arc(33.02,46.79) 32.45,47.02 R26.2 23.8,44.85 arc(23.89,44.62) D10.2
  Top Layer w0.762: R25.1 C50.2 R27.1
$1N11419: length 3
  Top Layer w0.508: U6.5 26.22,37.69 arc(27.19,37.5) 28.01,36.95 R25.2
$1N11452: length 33.1
  Top Layer w0.254: U6.7 U6.6
  Top Layer w0.508: 23.57,31.85 23.57,38.34 arc(23.74,38.75) 24.15,38.92 25.36,38.92 arc(25.39,38.93) U6.6 ; R27.2 27.29,40.98 arc(26.47,40.43) 25.5,40.23 U6.7 ; PR1.3 36.4,31.85 arc(36.65,31.95) H1.2
  Top Layer w0.762: H1.2 42.09,32.19 ; PR1.3 PR1.2
$1N12053: length 38.2
  Top Layer w0.508: PR2.2 22.53,18.4 arc(22.81,19.09) 23.5,19.37 25.11,19.37 arc(25.15,19.39) U7.6 25.17,20.71 25.82,20.71 arc(26.79,20.9) 27.62,21.45 R31.2 ; H2.2 36.75,13.92 arc(36.34,12.93) 35.35,12.52 25.05,12.52 arc(25.04,12.52) PR2.3
  Top Layer w0.762: H2.2 41.83,18 arc(41.87,18.02) U10.5 ; PR2.2 PR2.3
$1N12065: length 3.4
  Top Layer w0.508: U7.5 25.99,18.17 arc(26.96,17.97) 27.79,17.42 R29.2
$1N12071: length 25.1
  Top Layer w0.508: R31.1 32.75,22.02 arc(33.17,22.2) 33.35,22.62 33.35,26.22 arc(33.06,26.93) 32.35,27.22 R30.2
  Top Layer w0.762: R30.2 23.7,25.19 arc(23.84,24.86) D12.1 ; R29.1 R31.1
$1N12077: length 2.7
  Top Layer w0.508: U7.3 17.46,19.44 arc(17.24,19.53) R28.2
$1N12079: length 23.6
  Top Layer w0.508: v1(13.7,22.02) 13.7,23.01 arc(13.81,23.28) C51.1 ; D11.2 18.17,21.31 arc(18.84,20.86) 19.63,20.71
  Top Layer w0.762: C51.1 16.09,23.4 arc(16.44,23.25) D11.2
  Inner2 w0.508: v1(13.7,22.02) 13.7,13.57 arc(14.02,12.81) 14.78,12.5 PR2.1
$1N12087: length 11.7
  Top Layer w0.508: U7.1 20.46,21.98 arc(20.95,22.18) 21.15,22.67 21.15,24.7 arc(21.14,24.71) D12.2
  Top Layer w0.762: C51.2 16.04,25.4 arc(16.42,25.56) D11.1 17.07,25.46 arc(17.89,24.91) 18.86,24.72 D12.2
$1N12290: length 6.9
  Top Layer w0.762: U8.5 7.18,25.12 arc(7.19,25.12) C55.1 7.19,27.61 arc(7.19,27.62) NOREF#5.1
$1N12318: length 30.9
  Top Layer w0.508: R24.1 10.5,39.67 arc(9.57,39.29) 9.19,38.36 C55.2
  Top Layer w0.762: C55.2 9.19,20.78 arc(9.5,20.03) 10.25,19.72 15.12,19.72 arc(15.14,19.73) R28.1
$2N637: length 5.9
  Top Layer w0.305: R32.2 67.83,38.79 arc(67.85,38.79) U11.4
  Top Layer w0.762: R33.2 R32.2
$2N706: length 37.8
  Top Layer w0.457: 57.75,27.12 57.75,25.19 arc(57.72,25.12) H5.2 ; 57.75,27.12 57.75,44.82 arc(58.22,45.95) 59.35,46.42 C56.1 ; 57.75,27.12 arc(57.75,27.12) 57.76,27.12 R34.2
  Top Layer w0.762: U15.5 57.64,25.08 arc(57.65,25.08) H5.2
$2N759: length 9
  Top Layer w0.305: U11.3 69.15,39.42 arc(69.54,39.58) 69.7,39.97 69.7,41.87 arc(69.54,42.26) 69.15,42.42 67.4,42.42 arc(67.04,42.57) 66.89,42.93 C56.2
$2N792: length 8.6
  Top Layer w0.305: U11.6 69.15,37.47 arc(69.36,37.39) 69.45,37.17 69.45,33.68 arc(69.45,33.67) C57.2
  Top Layer w0.508: C57.2 67.44,31.66 R35.2
$2N878: length 29.8
  Top Layer w0.254: U11.5 66.35,38.12 arc(66,37.98) 65.85,37.62 v1(65.85,37.24) 65.85,33.68 arc(65.86,33.67) 65.87,33.66
  Top Layer w0.305: R35.1 64.24,33.66 arc(63.68,33.43) 63.45,32.87 63.45,27.14 arc(63.45,27.13) R51.1
  Inner2 w0.508: U14.2 65.85,37.22
$2N1047: length 3.7
  Top Layer w0.762: R40.1 58.7,16.52 arc(58.68,16.53) PR3.3
$2N1082: length 21.6
  Inner2 w0.508: U14.1 52.01,20.91 arc(52.3,20.21) 53,19.92 55.5,19.92 arc(55.99,19.72) 56.2,19.22 56.2,16.57 arc(56.19,16.55) PR3.2
$2N1528: length 2
  Top Layer w0.762: R42.2 D13.2
$2N1532: length 2
  Top Layer w0.762: R41.2 59.3,9.52 arc(59.34,9.54) D14.2
$2N1537: length 7.4
  Top Layer w0.762: CN25.2 CN25.1 68.65,3.67 arc(68.33,2.9) 67.55,2.57 64.53,2.57 arc(64.51,2.58) D16.1
$2N1538: length 7.4
  Top Layer w0.762: CN25.5 CN25.6 81.15,3.47 arc(81.41,2.84) 82.05,2.57 85.17,2.57 arc(85.19,2.58) D15.2
$2N1711: length 5.8
  Top Layer w0.305: U11.12 75.03,39.42 arc(75.85,39.26) R36.1
  Top Layer w0.762: 76.54,36.3 R36.1
$2N1732: length 9.6
  Top Layer w0.305: U11.11 72.25,38.77 arc(72,38.88) 71.89,39.13 C64.1
  Top Layer w0.762: R37.1 C64.1
$2N1871: length 3.6
  Top Layer w0.305: U11.13 74.11,40.07 74.11,40.08 74.9,40.08 74.9,40.07 75.31,40.07 C65.1
$2N1875: length 7
  Top Layer w0.305: R38.2 77.85,44.42 arc(78.34,44.22) 78.55,43.72 78.55,41.31 arc(78.55,41.3) C65.2
$2N1987: length 5.4
  Top Layer w0.305: U11.9 72.2,37.47 arc(71.92,37.36) 71.8,37.07 71.8,33.8 arc(71.84,33.7) C66.1
$2N2092: length 6
  Top Layer w0.305: U11.10 74.5,38.12 arc(74.78,38.01) 74.9,37.72 74.9,34.13 arc(74.76,33.8) C67.1
$2N2096: length 14.4
  Top Layer w0.305: C68.1 82.98,28.41 R39.1
  Top Layer w0.508: C67.2 77.11,31.66 arc(77.67,31.43) 77.9,30.87 77.9,27.32 arc(78.18,26.65) 78.85,26.37 80.94,26.37 arc(80.97,26.38) C68.1
$2N2126: length 11.5
  Top Layer w0.457: C68.2 80.98,30.05 arc(81.26,30.74) 81.95,31.02 90.25,31.02 arc(90.29,31.04) R43.1
$2N2286: length 10.9
  Top Layer w0.762: R43.2 arc(92.31,31.07) 92.31,31.06 H6.2 96.99,25.06 arc(97.06,25.09) U16.5
$2N2300: length 2.6
  Top Layer w0.305: U13.3 83.32,26.26 arc(83.37,26.37) R39.2
$2N2867: length 2.6
  Top Layer w0.305: U13.6 83.32,16.88 arc(83.36,16.8) C71.1
$2N2919: length 23
  Top Layer w0.305: R45.2 80.7,19.18 arc(81.13,19.35) 81.3,19.77 81.3,20.52 arc(81.46,20.91) 81.85,21.07 83.45,21.07 arc(83.8,20.93) 83.95,20.57 83.95,19.35 arc(83.96,19.33) U13.7 83.97,18.69 arc(83.98,18.62) 83.97,18.56 83.97,18.35 arc(84.08,18.08) 84.35,17.97 85.45,17.97 arc(85.77,17.84) 85.9,17.52 85.9,16.8 arc(85.91,16.78) R44.2
  Top Layer w0.457: R45.2 78.96,11.36 arc(79.21,10.77) 79.8,10.52 81.53,10.52 arc(81.57,10.54) H3.1
$2N3066: length 12.4
  Top Layer w0.381: U12.2 71.55,14.43 arc(71.56,14.42) C74.1
  Top Layer w0.508: R45.1 72.2,19.18 arc(71.74,18.99) 71.55,18.52 71.55,17.13 arc(71.55,17.12) U12.2
  Top Layer w0.762: R48.1 C74.1
$2N3072: length 14.8
  Top Layer w0.457: v1(75.6,21.67) 76.96,21.67 arc(76.96,21.67) C73.2 ; U12.3 72.82,15.8 arc(73.05,15.25) v1(73.6,15.02)
  Top Layer w0.762: R46.1 C73.2
  Inner2 w0.457: v1(73.6,15.02) 74.9,15.02 arc(75.39,15.23) 75.6,15.72 v1(75.6,21.67)
$2N3100: length 25
  Top Layer w0.457: R46.2 81.19,24.18 arc(81.2,24.18) v1(81.2,24.17)
  Top Layer w0.762: R47.1 v1(90.38,16.72) 94.42,16.72 arc(94.55,16.67) PR4.2
  Inner2 w0.457: v1(81.2,24.17) 89.75,24.17 arc(90.17,24) 90.35,23.57 90.35,16.67
$2N3468: length 9.9
  Top Layer w0.508: C75.2 65.98,15.04 arc(66.16,14.61) 66.6,14.42 69.56,14.42 arc(69.57,14.42) C74.2
  Top Layer w0.762: R48.2 C74.2
$2N3483: length 8.8
  Top Layer w0.508: R49.1 72.29,20.96 arc(72.65,21.11) 72.8,21.47 72.8,22.64 arc(72.81,22.66) U12.6
  Top Layer w0.762: C75.1 R49.1
$2N3598: length 6.7
  Top Layer w0.508: R49.2 65.98,25.08 arc(65.97,25.11) R50.1
  Top Layer w0.762: R51.2 R50.1
$3N1223: length 22.4
  Top Layer w0.508: C82.2 83.14,80.85 arc(83.27,80.9) U22.2 ; v1(78.65,72.05) 80.13,72.05 arc(80.13,72.05) 80.13,72.04 82.62,72.04 arc(82.64,72.05) C83.1
  Inner2 w0.508: v1(78.65,72.05) 78.65,80.17 arc(78.9,80.77) 79.5,81.02 83.31,81.02 arc(83.32,81.03) U22.2
$3N1226: length 2.6
  Top Layer w0.762: LED2.2 61.44,66.05 ; 61.39,66.05 arc(61.37,66.05) R54.2
$3N1228: length 2.4
  Top Layer w0.762: R6.1 93.08,65.99 ; 93.08,65.99 93.13,65.99 ; 93.08,65.99 arc(93.1,66) LED1.2
$3N1231: length 18.8
  Top Layer w0.508: R5.1 C83.2
  Top Layer w0.762: C83.2 87.85,72.07 arc(88.7,72.42) 89.05,73.27 arc(89.5,74.35) 90.57,74.79 H8.2 92.3,76.17 arc(92.7,77.13) 93.65,77.52 97.09,77.52 arc(97.11,77.51) 97.12,77.49
$3N1234: length 5
  Top Layer w0.508: R3.2 U22.1
$3N1235: length 13.5
  Top Layer w0.508: 78.1,92.27 82.33,92.27 arc(83.05,91.97) 83.35,91.25 83.35,83.6 arc(83.34,83.58) U22.3
$3N1239: length 4.3
  Top Layer w0.508: U21.3 R3.1
$3N1240: length 11
  Top Layer w0.508: U21.1 72.03,91.17 arc(72.35,91.95) 73.12,92.27 74.85,92.27
$3N1241: length 15.7
  Top Layer w0.508: U17.4 U17.5 ; v1(78.4,84.57) 78.4,83.24 arc(78.39,83.21) R52.1
  Inner2 w0.508: U17.4 68.6,84.62 arc(68.82,85.15) 69.35,85.37 77.6,85.37 arc(78.17,85.14) v1(78.4,84.57)
$3N1242: length 11.2
  Top Layer w0.508: U17.6 68.6,76.5 arc(68.84,75.92) 69.42,75.67 71.47,75.67 arc(72.01,75.45) 72.22,74.92 72.22,73.02 arc(72.22,73.02) R53.2 72.45,72.79 arc(73.28,72.24) 74.25,72.04 74.72,72.04
$3N1244: length 23.7
  Top Layer w0.508: R52.2 C82.1 arc(76.15,80.99) 75.9,81.04 U21.2 70.84,81.04 arc(70.37,80.84) 70.17,80.37 70.17,77.3 arc(70.34,76.89) 70.75,76.72 75.97,76.72 arc(76.5,76.5) 76.72,75.97 76.72,73.92 arc(76.55,73.5) 76.12,73.32 74.73,73.32 arc(74.72,73.32) U18.2
$3N1248: length 14.3
  Top Layer w0.762: NOREF.1 73.98,58.98 CN26.2 CN26.1 66.77,58.65 arc(66.75,58.65) D18.1
$3N1250: length 14.3
  Top Layer w0.762: NOREF#7.3 80.9,58.92 CN26.5 CN26.6 88.05,58.65 arc(88.07,58.65) D17.2
$3N1253: length 6.7
  Top Layer w0.508: U17.3 U17.2
  Top Layer w0.762: C79.2 65.09,79.46 arc(65.77,79.18) U17.3
$3N1254: length 7.4
  Top Layer w0.762: H7.2 62.5,77.36 arc(62.47,77.43) C79.1 arc(62.37,77.52) 62.31,77.55 U23.5

## Copper pours and planes (outline as drawn; the poured copper is in the pictures)
GND on Top Layer: -17.15,117.22 124.45,117.22 124.45,-22.88 -17.15,-22.88
GND on Bottom Layer: -17.8,120.27 118.65,120.27 118.65,-20.43 -17.8,-20.43
GND on Inner1: -29.2,120.32 152.9,120.32 152.9,-24.68 -29.2,-24.68
GND on Inner2: -20.15,117.57 133.85,117.57 133.85,-18.33 -20.15,-18.33

Small or netless copper shapes (teardrops, artwork), in the pictures only: 418 on Top Layer, 7 on Inner1, 23 on Inner2

## Text on the board
Top Solder Mask Layer: AD637峰值检测 | AGC_AD8367 | 峰值检测
Top Silkscreen Layer: 连接SB1与SB3 / 断开SB2同相放大器 | 断开SB1与SB3 / 单独SB2反向放大器 | 可变增益 | 固定增益 | 程控增益 | 手控增益 | VCA增益调节 | 检波输出 | AGC增益调节 | 电压测试点 | -5V | GND | +5V | 增益调节
